# EAGLE board driver_board (EAGLE 6.4)
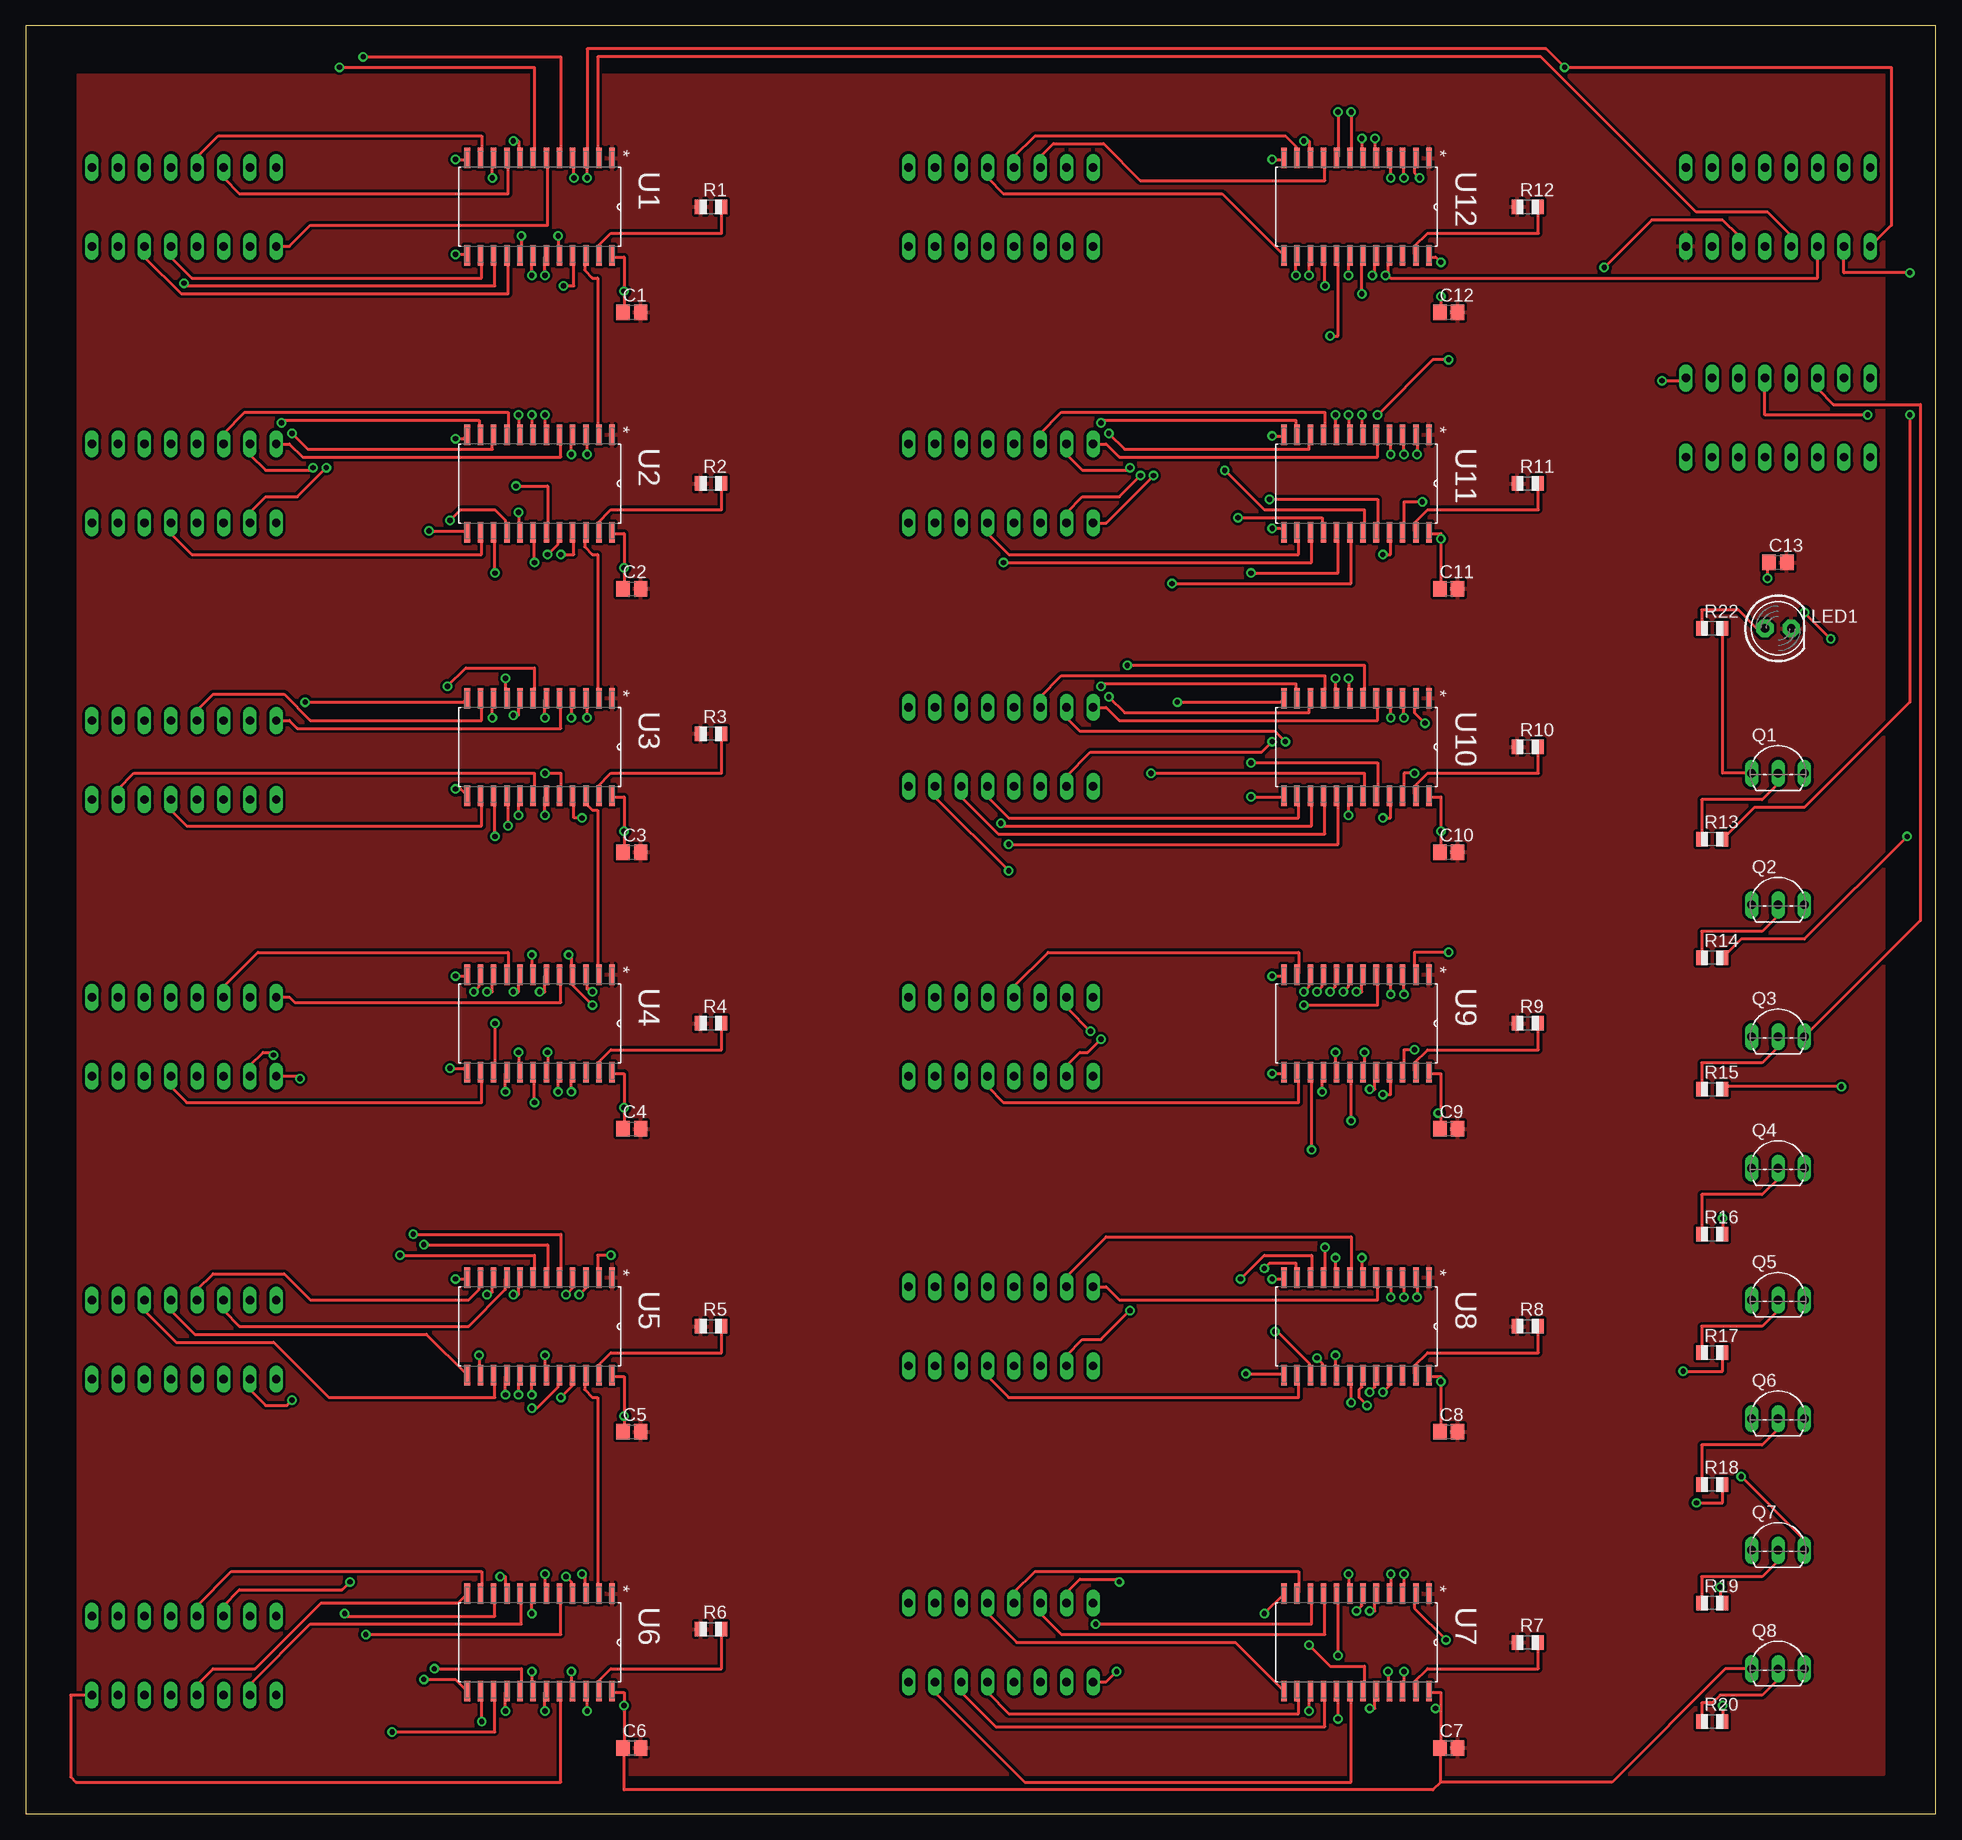
[diagram p2: board, top side]
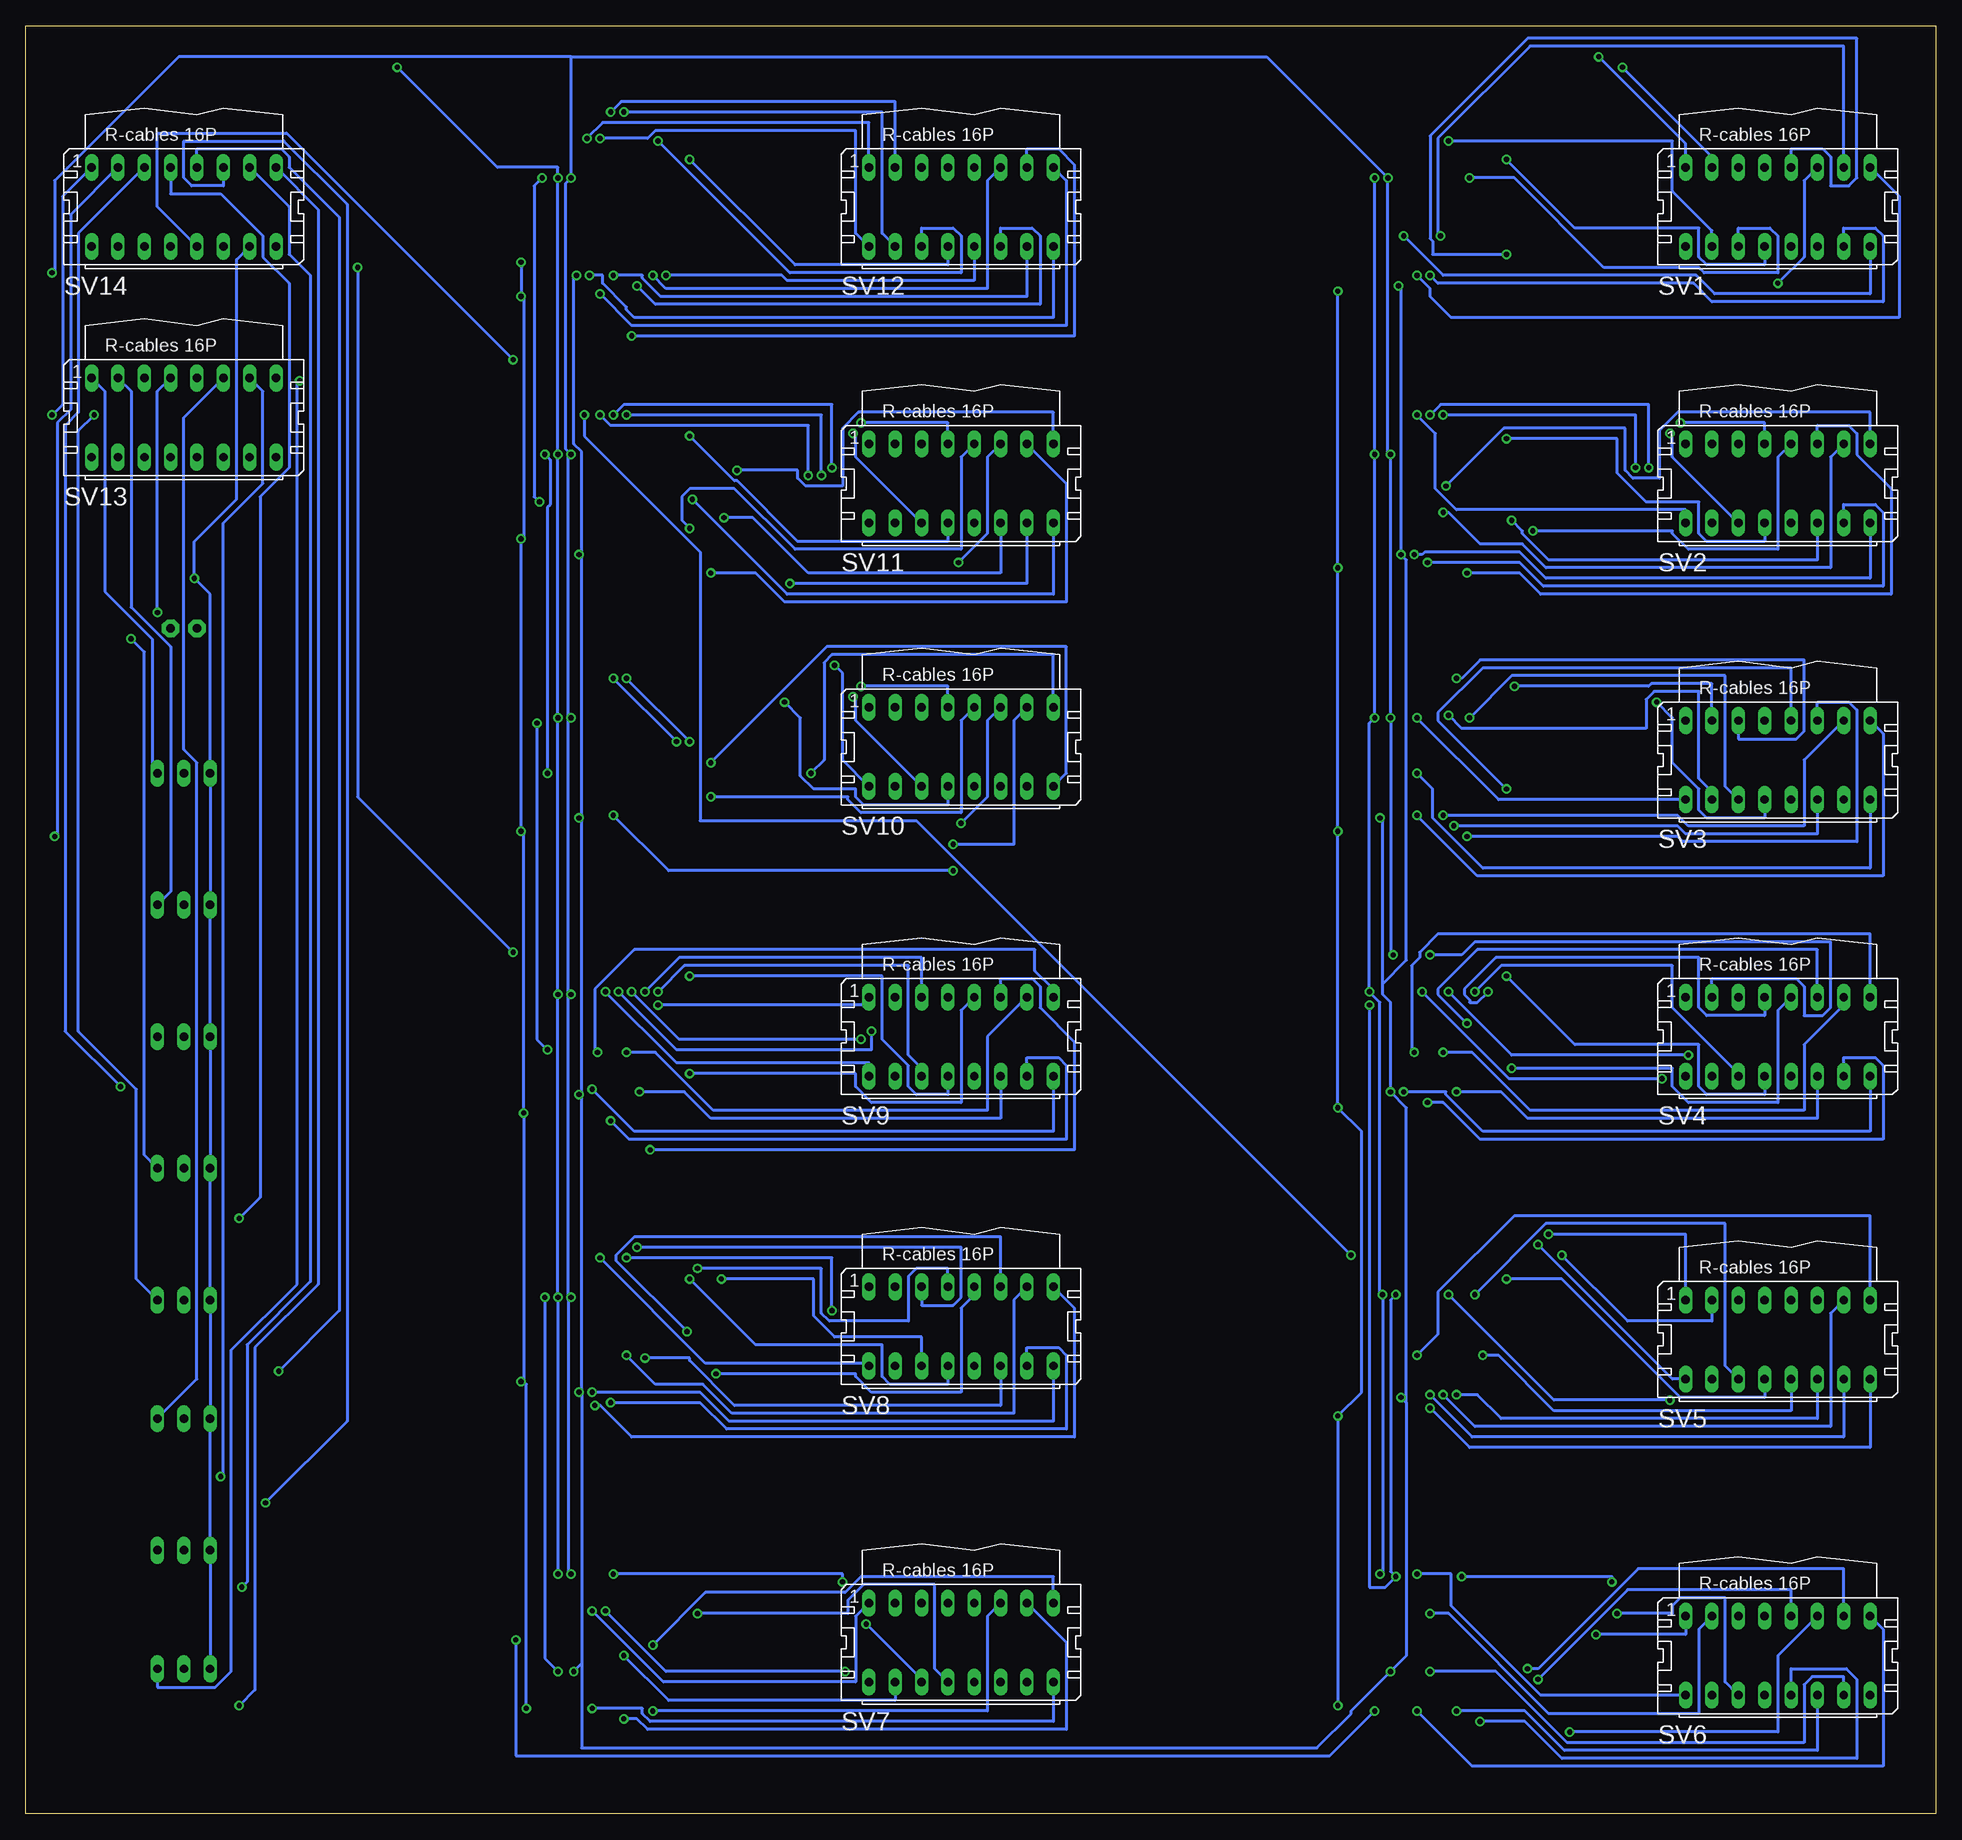
[diagram p3: board, bottom side, seen from below]

Size 184.13 x 172.39 mm. Coordinates in mm from the lower left corner, seen from the top.
Outline: 0,0 184.13,0 184.13,172.39 0,172.39 0,0
Copper layers (1*16): Top 0.035mm / dielectric 1.5mm / Bottom 0.035mm
Design rules "default *": minimum track width 10mil, minimum drill 10mil, track to track 8mil, track to pad 8mil, pad to pad 8mil, via to via 8mil, smd to smd 8mil, copper to edge 40mil, drill to drill 8mil, minimum pad ring 10mil, minimum via ring 8mil, stop-mask expansion 4mil, vias tented up to drill 0mil, thermal gap 10mil
Net classes: 0 default: width 0.305 mm, drill 0.508 mm, clearance 0.254 mm

## Footprints (pad centres in the part's own frame; a part is rotated, then mirrored left to right if it is on the bottom)
C0805 = smd 1.3 x 1.5: 1 -0.85,0; 2 0.85,0
LED5MM = drill 0.813 pad 1.676 octagon: A -1.27,0; K 1.27,0
TO92-EBC-OVAL = drill 0.813 long: B 0,-1.27; C 2.54,-1.27; E -2.54,-1.27
R0805 = smd 1.1 x 1.4: 1 -1,0; 2 1,0
16PL = drill 0.813 long: 1 -8.89,3.81; 2 -8.89,-3.81; 3 -6.35,3.81; 4 -6.35,-3.81; 5 -3.81,3.81; 6 -3.81,-3.81; 7 -1.27,3.81; 8 -1.27,-3.81; 9 1.27,3.81; 10 1.27,-3.81; 11 3.81,3.81; 12 3.81,-3.81; 13 6.35,3.81; 14 6.35,-3.81; 15 8.89,3.81; 16 8.89,-3.81
SOIC127P1032X265-24N = smd 1.981 x 0.533: 1 -4.699,6.985; 2 -4.699,5.715; 3 -4.699,4.445; 4 -4.699,3.175; 5 -4.699,1.905; 6 -4.699,0.635; 7 -4.699,-0.635; 8 -4.699,-1.905; 9 -4.699,-3.175; 10 -4.699,-4.445; 11 -4.699,-5.715; 12 -4.699,-6.985; 13 4.699,-6.985; 14 4.699,-5.715; 15 4.699,-4.445; 16 4.699,-3.175; 17 4.699,-1.905; 18 4.699,-0.635; 19 4.699,0.635; 20 4.699,1.905; 21 4.699,3.175; 22 4.699,4.445; 23 4.699,5.715; 24 4.699,6.985

## Placement (x,y rotation side)
C1  [C0805]  58.42,144.78 0 top
C2  [C0805]  58.42,118.11 0 top
C3  [C0805]  58.42,92.71 0 top
C4  [C0805]  58.42,66.04 0 top
C5  [C0805]  58.42,36.83 0 top
C6  [C0805]  58.42,6.35 0 top
C7  [C0805]  137.16,6.35 0 top
C8  [C0805]  137.16,36.83 0 top
C9  [C0805]  137.16,66.04 0 top
C10  [C0805]  137.16,92.71 0 top
C11  [C0805]  137.16,118.11 0 top
C12  [C0805]  137.16,144.78 0 top
C13  [C0805]  168.91,120.65 0 top
LED1  GREEN  [LED5MM]  168.91,114.3 0 top
Q1  2N2907  [TO92-EBC-OVAL]  168.91,101.6 0 top
Q2  2N2907  [TO92-EBC-OVAL]  168.91,88.9 0 top
Q3  2N2907  [TO92-EBC-OVAL]  168.91,76.2 0 top
Q4  2N2907  [TO92-EBC-OVAL]  168.91,63.5 0 top
Q5  2N2907  [TO92-EBC-OVAL]  168.91,50.8 0 top
Q6  2N2907  [TO92-EBC-OVAL]  168.91,39.37 0 top
Q7  2N2907  [TO92-EBC-OVAL]  168.91,26.67 0 top
Q8  2N2907  [TO92-EBC-OVAL]  168.91,15.24 0 top
R1  1K  [R0805]  66.04,154.94 0 top
R2  1K  [R0805]  66.04,128.27 0 top
R3  1K  [R0805]  66.04,104.14 0 top
R4  1K  [R0805]  66.04,76.2 0 top
R5  1K  [R0805]  66.04,46.99 0 top
R6  1K  [R0805]  66.04,17.78 0 top
R7  1K  [R0805]  144.78,16.51 0 top
R8  1K  [R0805]  144.78,46.99 0 top
R9  1K  [R0805]  144.78,76.2 0 top
R10  1K  [R0805]  144.78,102.87 0 top
R11  1K  [R0805]  144.78,128.27 0 top
R12  1K  [R0805]  144.78,154.94 0 top
R13  1k  [R0805]  162.56,93.98 0 top
R14  1k  [R0805]  162.56,82.55 0 top
R15  1k  [R0805]  162.56,69.85 0 top
R16  1k  [R0805]  162.56,55.88 0 top
R17  1k  [R0805]  162.56,44.45 0 top
R18  1k  [R0805]  162.56,31.75 0 top
R19  1k  [R0805]  162.56,20.32 0 top
R20  1k  [R0805]  162.56,8.89 0 top
R22  220  [R0805]  162.56,114.3 0 top
SV1  [16PL]  15.24,154.94 0 bottom
SV2  [16PL]  15.24,128.27 0 bottom
SV3  [16PL]  15.24,101.6 0 bottom
SV4  [16PL]  15.24,74.93 0 bottom
SV5  [16PL]  15.24,45.72 0 bottom
SV6  [16PL]  15.24,15.24 0 bottom
SV7  [16PL]  93.98,16.51 0 bottom
SV8  [16PL]  93.98,46.99 0 bottom
SV9  [16PL]  93.98,74.93 0 bottom
SV10  [16PL]  93.98,102.87 0 bottom
SV11  [16PL]  93.98,128.27 0 bottom
SV12  [16PL]  93.98,154.94 0 bottom
SV13  [16PL]  168.91,134.62 0 bottom
SV14  [16PL]  168.91,154.94 0 bottom
U1  STP16CPP05MTR  [SOIC127P1032X265-24N]  49.53,154.94 270 top
U2  STP16CPP05MTR  [SOIC127P1032X265-24N]  49.53,128.27 270 top
U3  STP16CPP05MTR  [SOIC127P1032X265-24N]  49.53,102.87 270 top
U4  STP16CPP05MTR  [SOIC127P1032X265-24N]  49.53,76.2 270 top
U5  STP16CPP05MTR  [SOIC127P1032X265-24N]  49.53,46.99 270 top
U6  STP16CPP05MTR  [SOIC127P1032X265-24N]  49.53,16.51 270 top
U7  STP16CPP05MTR  [SOIC127P1032X265-24N]  128.27,16.51 270 top
U8  STP16CPP05MTR  [SOIC127P1032X265-24N]  128.27,46.99 270 top
U9  STP16CPP05MTR  [SOIC127P1032X265-24N]  128.27,76.2 270 top
U10  STP16CPP05MTR  [SOIC127P1032X265-24N]  128.27,102.87 270 top
U11  STP16CPP05MTR  [SOIC127P1032X265-24N]  128.27,128.27 270 top
U12  STP16CPP05MTR  [SOIC127P1032X265-24N]  128.27,154.94 270 top

## Tracks (layer width: path | path; a pad name or v marks a point on that pad's centre or on a via)
+3V3  (via drill 0.51)
  Top 0.305: C1.1 57.66,144.78 v57.66,146.81 57.66,150.11 56.64,150.11 U1.24 | C2.1 57.66,118.11 v57.66,120.14 57.66,123.44 56.64,123.44 U2.24 | C3.1 57.66,92.71 v57.66,94.74 57.66,98.04 56.64,98.04 U3.24 | C4.1 57.66,66.04 v57.66,68.07 57.66,71.37 56.64,71.37 U4.24 | 57.66,6.35 v57.66,10.41 57.66,11.68 56.64,11.68 U6.24 | C5.1 57.66,36.83 v57.66,38.35 57.66,42.16 56.64,42.16 U5.24 | C11.1 136.4,118.11 v136.4,122.94 136.4,123.44 135.38,123.44 U11.24 | v136.4,146.3 136.4,144.78 C12.1 | v136.4,149.61 135.89,150.11 135.38,150.11 U12.24 | C10.1 136.4,92.71 v136.4,94.74 136.4,98.04 135.38,98.04 U10.24 | C8.1 136.4,36.83 v136.4,41.66 136.4,42.16 135.38,42.16 U8.24 | 136.4,67.56 136.4,71.37 135.38,71.37 U9.24 | 136.4,67.56 136.4,66.04 C9.1 | 136.4,67.56 v136.14,67.56 | Q1.E 163.58,100.33 163.58,114.3 R22.2 | v167.89,119.13 167.89,120.65 C13.1 | 136.4,9.91 136.4,11.68 135.38,11.68 U7.24 | 136.4,9.91 136.4,6.35 | 136.4,3.05 136.4,6.35 | 136.4,3.05 152.91,3.05 163.83,13.97 Q8.E | 136.4,6.35 C7.1 | v135.89,10.16 136.14,9.91 136.4,9.91 | 57.66,6.35 57.66,2.29 135.64,2.29 136.4,3.05 | 57.66,6.35 C6.1
  Bottom 0.305: v57.66,10.41 v57.66,38.35 55.37,40.64 55.37,65.79 v57.66,68.07 v57.66,94.74 v57.66,120.14 v57.66,146.81 | v136.4,149.61 v136.4,146.3 136.14,146.05 136.14,122.94 v136.4,122.94 v136.4,94.74 136.14,94.49 v136.14,67.56 136.14,41.66 | SV14.14 163.83,149.86 163.83,126.75 167.89,122.68 v167.89,119.13 166.37,117.6 Q1.E Q2.E Q3.E Q4.E Q5.E Q6.E Q7.E Q8.E | 136.14,41.66 135.89,41.4 v135.89,10.16 | 136.14,41.66 v136.4,41.66
CLK  (via drill 0.51)
  Top 0.305: v53.59,23.11 53.85,23.11 53.85,21.34 U6.3 | v53.34,50.04 54.1,50.8 54.1,51.56 U5.3 | v54.61,79.25 54.36,79.5 54.1,79.5 54.1,80.77 U4.3 | v54.1,105.66 54.1,107.44 U3.3 | v54.1,131.06 54.1,132.84 U2.3 | v54.1,157.73 54.1,159.51 U1.3 54.1,159.77 54.1,170.18 146.56,170.18 v148.34,168.4 179.83,168.4 179.83,153.16 SV14.2 | v132.84,23.11 132.84,21.34 U7.3 | v132.84,49.78 132.84,51.56 U8.3 | v132.84,78.99 132.84,80.77 U9.3 | v132.84,105.66 132.84,107.44 U10.3 | v132.84,131.06 132.84,132.84 U11.3 | v132.84,157.73 132.84,159.51 U12.3
  Bottom 0.305: v53.59,23.11 53.34,23.37 v53.34,50.04 53.59,50.29 53.59,78.23 v54.61,79.25 54.61,105.16 v54.1,105.66 v54.1,131.06 v54.1,157.73 | v132.84,23.11 v132.84,49.78 v132.84,78.99 v132.84,105.66 v132.84,131.06 v132.84,157.73 132.84,158.75 138.68,158.75 v148.34,168.4
GND
  pour Top: 5.08,167.64 179.07,167.64 179.07,3.81 5.08,3.81
LE  (via drill 0.51)
  Top 0.305: v52.07,22.86 52.58,22.35 52.58,21.34 U6.4 | v52.07,50.04 52.83,50.8 52.83,51.56 U5.4 | v52.32,82.8 52.58,82.8 52.58,81.03 U4.4 52.58,80.77 52.58,80.01 v54.61,77.98 | v52.58,105.66 52.58,107.44 U3.4 | v52.58,131.06 52.58,132.84 U2.4 | v52.83,157.73 52.83,159.51 U1.4 | v131.57,23.11 131.57,21.34 U7.4 | v131.57,49.78 131.57,51.56 U8.4 | v131.57,78.99 131.57,80.77 U9.4 | v131.57,105.66 131.57,107.44 U10.4 | v131.57,131.06 131.57,132.84 U11.4 | v131.57,157.73 131.57,159.51 U12.4 | SV14.4 175.26,148.59 v181.61,148.59
  Bottom 0.305: v52.07,50.04 52.58,49.53 52.58,23.37 v52.07,22.86 53.09,21.84 54.61,21.84 v54.61,77.98 | v52.32,82.8 52.58,83.06 v52.58,105.66 v52.58,131.06 52.83,131.32 v52.83,157.73 64.52,169.42 131.57,169.42 | v131.57,23.11 131.83,23.37 131.83,49.53 | 131.83,49.53 131.83,78.74 | 131.83,49.53 v131.57,49.78 | 131.83,78.74 131.83,105.41 | 131.83,78.74 v131.57,78.99 | 131.83,105.41 131.83,130.81 v131.57,131.06 132.08,131.57 132.08,157.23 v131.57,157.73 131.57,169.42 | 131.83,105.41 v131.57,105.66 | v181.61,148.59 181.36,148.84 181.36,157.48 169.42,169.42 131.57,169.42
N$1  (via drill 0.51)
  Top 0.305: v32.51,169.42 51.56,169.42 51.56,159.77 U1.5
  Bottom 0.305: v32.51,169.42 24.13,161.04 SV1.1
N$2
  Top 0.305: SV1.5 19.05,157.73 20.57,156.21 46.48,156.21 46.48,159.51 U1.9
N$3  (via drill 0.51)
  Top 0.305: v30.23,168.4 49.02,168.4 49.02,159.77 U1.7
  Bottom 0.305: v30.23,168.4 21.59,159.77 SV1.3
N$4
  Top 0.305: SV1.7 16.51,159.77 18.54,161.8 43.94,161.8 43.94,159.77 U1.11
N$5  (via drill 0.51)
  Top 0.305: v15.24,147.57 15.49,147.32 45.21,147.32 45.21,150.11 U1.15
  Bottom 0.305: v15.24,147.57 12.7,150.11 12.7,157.48 SV1.11
N$6  (via drill 0.51)
  Top 0.305: v47.75,152.15 47.75,150.37 U1.17
  Bottom 0.305: v47.75,152.15 48.01,152.4 48.01,161.54 39.12,170.43 8.89,170.43 SV1.13
N$7  (via drill 0.51)
  Top 0.305: v41.4,150.37 42.42,150.37 U1.13
  Bottom 0.305: v41.4,150.37 48.51,150.37 48.51,151.64 48.77,151.89 48.77,161.8 39.37,171.2 7.62,171.2 7.62,157.73 8.38,156.97 10.16,156.97 10.16,159.77 10.92,160.53 13.97,160.53 SV1.9
N$8  (via drill 0.51)
  Top 0.305: v50.04,148.34 50.04,150.11 U1.19
  Bottom 0.305: v50.04,148.34 48.77,147.07 48.77,146.3 46.74,144.27 3.56,144.27 3.56,155.96 SV1.15
N$9
  Top 0.305: SV1.2 25.4,151.13 27.43,153.16 50.29,153.16 50.29,159.51 U1.6
N$10  (via drill 0.51)
  Top 0.305: v46.99,161.29 47.5,161.29 47.5,159.77 U1.8
  Bottom 0.305: v46.99,161.29 25.4,161.29 25.4,156.46 21.59,152.65 SV1.4
N$11  (via drill 0.51)
  Top 0.305: v44.96,157.73 44.96,159.51 U1.10
  Bottom 0.305: v44.96,157.73 40.64,157.73 32,149.1 22.86,149.1 22.35,148.59 15.24,148.59 15.24,152.15 16,152.91 19.05,152.91 SV1.6
N$12  (via drill 0.51)
  Top 0.305: v41.4,159.51 42.42,159.51 U1.12
  Bottom 0.305: v41.4,159.51 34.8,152.91 22.86,152.91 22.86,150.11 22.1,149.35 16.51,149.35 SV1.8
N$13
  Top 0.305: SV1.10 13.97,150.11 16,148.08 43.94,148.08 43.94,150.11 U1.14
N$14
  Top 0.305: SV1.12 11.43,150.11 14.99,146.56 46.48,146.56 46.48,150.11 U1.16
N$15  (via drill 0.51)
  Top 0.305: v48.77,148.34 48.77,150.11 U1.18
  Bottom 0.305: v48.77,148.34 48.01,147.57 23.37,147.57 21.59,145.8 5.08,145.8 5.08,152.15 5.84,152.91 8.89,152.91 SV1.14
N$16  (via drill 0.51)
  Top 0.305: v51.31,152.15 51.31,150.37 U1.20
  Bottom 0.305: v51.31,152.15 47.5,148.34 23.11,148.34 21.34,146.56 6.35,146.56 SV1.16
N$18
  Top 0.305: SV2.1 25.4,132.08 26.67,130.81 51.56,130.81 51.56,132.84 U2.5
N$19
  Top 0.305: R1.2 67.06,154.94 67.06,152.4 56.39,152.4 55.12,151.13 55.12,150.37 U1.23
N$20  (via drill 0.51)
  Top 0.305: v48.77,134.87 48.77,133.1 U2.7 | v27.69,129.79 27.43,129.54 23.11,129.54 21.59,131.06 SV2.3
  Bottom 0.305: v48.77,134.87 47.75,135.89 27.69,135.89 v27.69,129.79
N$21
  Top 0.305: SV2.5 19.05,133.1 21.08,135.13 46.48,135.13 46.48,133.1 U2.9
N$22  (via drill 0.51)
  Top 0.305: v24.64,134.11 24.89,134.37 43.69,134.37 43.69,133.1 U2.11
  Bottom 0.305: v24.64,134.11 16.51,134.11 SV2.7
N$23  (via drill 0.51)
  Top 0.305: v45.21,119.63 45.21,123.44 U2.15
  Bottom 0.305: v45.21,119.63 40.13,119.63 38.1,117.6 4.32,117.6 4.32,127.76 7.62,131.06 7.62,133.1 8.38,133.86 11.43,133.86 SV2.11
N$24  (via drill 0.51)
  Top 0.305: v38.86,123.7 42.42,123.7 U2.13
  Bottom 0.305: v38.86,123.7 25.4,123.7 25.4,123.44 23.88,121.92 15.24,121.92 15.24,130.81 SV2.9
N$25  (via drill 0.51)
  Top 0.305: v47.5,125.48 47.5,123.7 U2.17
  Bottom 0.305: v47.5,125.48 46.99,125.48 43.94,122.43 39.88,122.43 37.59,120.14 10.16,120.14 10.16,130.81 SV2.13
N$26  (via drill 0.51)
  Top 0.305: v47.24,128.02 50.29,128.02 50.29,123.7 U2.19
  Bottom 0.305: v47.24,128.02 41.66,133.6 29.97,133.6 29.97,129.54 29.21,128.78 26.67,128.78 26.67,133.35 24.89,135.13 6.35,135.13 SV2.15
N$27  (via drill 0.51)
  Top 0.305: v50.04,134.87 50.04,133.1 U2.6
  Bottom 0.305: v50.04,134.87 48.26,133.1 48.26,127.76 46.23,125.73 24.13,125.73 SV2.2
N$28  (via drill 0.51)
  Top 0.305: v47.5,134.87 47.5,133.1 U2.8 | v28.96,129.79 26.16,127 23.11,127 21.59,125.48 SV2.4
  Bottom 0.305: v47.5,134.87 28.96,134.87 v28.96,129.79
N$29  (via drill 0.51)
  Top 0.305: v25.65,133.1 27.18,131.57 44.96,131.57 44.96,132.84 U2.10
  Bottom 0.305: v25.65,133.1 25.4,132.84 25.4,130.81 SV2.6
N$30  (via drill 0.51)
  Top 0.305: U2.12 42.16,132.59 v41.4,132.59
  Bottom 0.305: v41.4,132.59 30.73,132.59 30.73,129.29 27.94,126.49 22.86,126.49 22.86,123.44 22.1,122.68 16.51,122.68 SV2.8
N$31
  Top 0.305: SV2.10 13.97,123.44 16,121.41 43.94,121.41 43.94,123.44 U2.14
N$32  (via drill 0.51)
  Top 0.305: v40.89,124.71 41.91,125.73 45.21,125.73 46.23,124.71 46.23,123.7 U2.16
  Bottom 0.305: v40.89,124.71 39.88,123.7 39.88,123.44 37.34,120.9 11.43,120.9 SV2.12
N$33  (via drill 0.51)
  Top 0.305: v49.02,120.65 49.02,123.44 U2.18
  Bottom 0.305: v49.02,120.65 40.13,120.65 37.85,118.36 5.08,118.36 5.08,125.48 5.84,126.24 8.89,126.24 SV2.14
N$34  (via drill 0.51)
  Top 0.305: v50.29,121.41 51.31,122.43 51.31,123.44 U2.20
  Bottom 0.305: v50.29,121.41 49.53,121.41 49.28,121.67 40.13,121.67 37.59,119.13 6.35,119.13 SV2.16
N$36
  Top 0.305: R2.2 67.06,128.27 67.06,125.73 56.39,125.73 55.12,124.46 55.12,123.7 U2.23
N$37
  Top 0.305: SV3.1 25.4,105.41 26.16,104.65 51.56,104.65 51.56,107.44 U3.5
N$38  (via drill 0.51)
  Top 0.305: v40.64,108.71 42.42,110.49 49.02,110.49 49.02,107.7 U3.7
  Bottom 0.305: v40.64,108.71 27.69,108.71 27.43,108.97 21.59,108.97 SV3.3
N$39  (via drill 0.51)
  Top 0.305: v46.23,109.47 46.23,107.7 U3.9
  Bottom 0.305: v46.23,109.47 45.72,109.47 43.94,111.25 12.7,111.25 12.7,104.39 13.46,103.63 19.05,103.63 SV3.5
N$40
  Top 0.305: SV3.7 16.51,106.43 18.03,107.95 24.89,107.95 27.43,105.41 43.94,105.41 43.94,107.44 U3.11
N$41  (via drill 0.51)
  Top 0.305: v45.21,94.23 45.21,98.04 U3.15
  Bottom 0.305: v45.21,94.23 24.89,94.23 24.38,93.73 7.62,93.73 7.62,106.43 8.38,107.19 11.43,107.19 SV3.11
N$42  (via drill 0.51)
  Top 0.305: U3.13 41.91,98.81 v41.4,98.81
  Bottom 0.305: v41.4,98.81 48.01,105.41 48.01,106.17 43.69,110.49 13.97,110.49 SV3.9
N$43  (via drill 0.51)
  Top 0.305: v47.5,96.27 47.5,98.04 U3.17
  Bottom 0.305: v47.5,96.27 24.89,96.27 23.88,95.25 12.7,95.25 12.7,101.6 SV3.13
N$44  (via drill 0.51)
  Top 0.305: v50.04,96.27 50.04,98.04 U3.19
  Bottom 0.305: v50.04,96.27 44.2,90.42 5.08,90.42 5.08,104.14 SV3.15
N$45  (via drill 0.51)
  Top 0.305: v50.04,105.66 50.04,107.44 U3.6
  Bottom 0.305: v50.04,105.66 42.16,97.79 SV3.2
N$46  (via drill 0.51)
  Top 0.305: v46.99,105.92 47.5,105.92 47.5,107.44 U3.8
  Bottom 0.305: v46.99,105.92 45.72,104.65 27.94,104.65 27.94,107.44 27.18,108.2 22.86,108.2 22.86,99.82 21.59,98.55 SV3.4
N$47  (via drill 0.51)
  Top 0.305: v44.96,105.66 44.96,107.44 U3.10
  Bottom 0.305: v44.96,105.66 40.89,109.73 20.32,109.73 20.32,99.06 SV3.6
N$48  (via drill 0.51)
  Top 0.305: U3.12 42.16,107.19 v26.92,107.19
  Bottom 0.305: v26.92,107.19 25.4,105.66 25.4,101.35 22.86,98.81 22.86,96.77 22.1,96.01 16.51,96.01 SV3.8
N$49
  Top 0.305: SV3.10 13.97,96.77 15.49,95.25 43.94,95.25 43.94,98.04 U3.14
N$50  (via drill 0.51)
  Top 0.305: v46.48,95.25 46.48,98.04 U3.16
  Bottom 0.305: v46.48,95.25 24.89,95.25 24.13,94.49 11.43,94.49 SV3.12
N$51
  Top 0.305: SV3.14 8.89,98.81 10.41,100.33 49.02,100.33 49.02,98.3 U3.18
N$52  (via drill 0.51)
  Top 0.305: v50.04,100.33 51.56,100.33 51.56,98.3 U3.20
  Bottom 0.305: v50.04,100.33 48.51,98.81 48.51,96.01 43.69,91.19 6.35,91.19 SV3.16
N$54
  Top 0.305: R3.2 67.06,104.14 67.06,100.33 56.39,100.33 55.12,99.06 55.12,98.3 U3.23
N$55
  Top 0.305: SV4.1 25.4,78.74 25.91,78.23 51.56,78.23 51.56,80.77 U4.5
N$56  (via drill 0.51)
  Top 0.305: v48.77,82.8 48.77,81.03 U4.7
  Bottom 0.305: v48.77,82.8 45.72,82.8 44.45,84.07 10.16,84.07 10.16,77.72 10.92,76.96 12.7,76.96 12.7,79.76 13.46,80.52 21.59,80.52 SV4.3
N$57
  Top 0.305: SV4.5 19.05,79.76 22.35,83.06 46.48,83.06 46.48,81.03 U4.9
N$58  (via drill 0.51)
  Top 0.305: v43.18,79.25 43.69,79.76 43.69,80.77 U4.11
  Bottom 0.305: v43.18,79.25 44.2,78.23 44.96,78.23 44.96,78.49 45.47,78.99 45.47,79.5 42.42,82.55 22.86,82.55 22.86,77.72 22.1,76.96 16.51,76.96 SV4.7
N$59  (via drill 0.51)
  Top 0.305: v45.21,76.2 45.21,71.63 U4.15
  Bottom 0.305: v45.21,76.2 48.01,78.99 48.01,79.5 44.2,83.31 11.43,83.31 SV4.11
N$60  (via drill 0.51)
  Top 0.305: U4.13 42.16,71.88 v40.89,71.88
  Bottom 0.305: v40.89,71.88 25.4,71.88 25.4,70.1 23.88,68.58 15.24,68.58 15.24,77.47 SV4.9
N$61  (via drill 0.51)
  Top 0.305: v47.5,73.41 47.5,71.63 U4.17
  Bottom 0.305: v47.5,73.41 44.7,73.41 39.12,67.82 12.7,67.82 12.7,74.17 8.89,77.98 SV4.13
N$62  (via drill 0.51)
  Top 0.305: v50.29,73.41 50.29,71.63 U4.19
  Bottom 0.305: v50.29,73.41 50.55,73.66 50.55,81.79 49.78,82.55 49.78,83.06 48.01,84.84 6.35,84.84 SV4.15
N$63  (via drill 0.51)
  Top 0.305: v49.53,79.25 50.04,79.25 50.04,80.77 U4.6 | v26.42,70.87 26.16,71.12 SV4.2
  Bottom 0.305: v49.53,79.25 41.15,70.87 v26.42,70.87
N$64  (via drill 0.51)
  Top 0.305: v46.99,79.25 47.5,79.25 47.5,80.77 U4.8 | v23.88,73.15 23.62,73.41 22.86,73.41 21.59,72.14 SV4.4
  Bottom 0.305: v46.99,79.25 40.89,73.15 v23.88,73.15
N$65  (via drill 0.51)
  Top 0.305: v44.45,79.25 44.96,79.25 44.96,80.77 U4.10
  Bottom 0.305: v44.45,79.25 41.91,81.79 25.4,81.79 25.4,77.72 19.05,71.37 SV4.6
N$66  (via drill 0.51)
  Top 0.305: v41.4,80.77 42.42,80.77 U4.12
  Bottom 0.305: v41.4,80.77 34.8,74.17 22.86,74.17 22.86,70.1 22.1,69.34 16.51,69.34 SV4.8
N$67
  Top 0.305: SV4.10 13.97,70.1 15.49,68.58 43.94,68.58 43.94,71.37 U4.14
N$68  (via drill 0.51)
  Top 0.305: v46.23,69.6 46.23,71.37 U4.16
  Bottom 0.305: v46.23,69.6 41.91,69.6 39.37,67.06 11.43,67.06 SV4.12
N$69  (via drill 0.51)
  Top 0.305: v49.02,68.58 49.02,71.37 U4.18
  Bottom 0.305: v49.02,68.58 47.5,68.58 43.94,65.02 5.08,65.02 5.08,72.14 5.84,72.9 8.89,72.9 SV4.14
N$70  (via drill 0.51)
  Top 0.305: v51.31,69.6 51.31,71.37 U4.20
  Bottom 0.305: v51.31,69.6 47.24,69.6 47.24,69.34 43.69,65.79 6.35,65.79 SV4.16
N$72
  Top 0.305: R4.2 67.06,76.2 67.06,73.66 56.39,73.66 55.12,72.39 55.12,71.63 U4.23
N$73  (via drill 0.51)
  Top 0.305: v37.34,55.88 51.56,55.88 51.56,51.82 U5.5
  Bottom 0.305: v37.34,55.88 24.13,55.88 SV5.1
N$74  (via drill 0.51)
  Top 0.305: v36.07,53.85 49.02,53.85 49.02,51.82 U5.7
  Bottom 0.305: v36.07,53.85 29.72,47.5 21.59,47.5 SV5.3
N$75
  Top 0.305: SV5.5 19.05,48.51 20.57,46.99 42.67,46.99 46.23,50.55 46.23,51.56 U5.9
N$76
  Top 0.305: SV5.7 16.51,50.55 18.03,52.07 24.89,52.07 27.43,49.53 42.67,49.53 43.69,50.55 43.69,51.56 U5.11
N$77
  Top 0.305: SV5.11 11.43,48.51 14.48,45.47 23.88,45.47 29.21,40.13 45.21,40.13 45.21,42.16 U5.15
N$78
  Top 0.305: U5.13 38.61,46.23 16.26,46.23 13.97,48.51 SV5.9
N$79  (via drill 0.51)
  Top 0.305: v47.5,40.39 47.5,42.16 U5.17
  Bottom 0.305: v47.5,40.39 44.45,37.34 10.16,37.34 10.16,48.26 SV5.13
N$80  (via drill 0.51)
  Top 0.305: v50.04,44.2 50.04,42.42 U5.19
  Bottom 0.305: v50.04,44.2 48.01,46.23 48.01,50.29 40.64,57.66 6.35,57.66 SV5.15
N$81  (via drill 0.51)
  Top 0.305: v38.35,54.86 50.29,54.86 50.29,51.82 U5.6
  Bottom 0.305: v38.35,54.86 25.4,41.91 SV5.2
N$82  (via drill 0.51)
  Top 0.305: v46.99,50.04 47.5,50.04 47.5,51.56 U5.8 | v25.65,39.88 25.15,39.37 23.11,39.37 21.59,40.89 SV5.4
  Bottom 0.305: v46.99,50.04 36.83,39.88 v25.65,39.88
N$83  (via drill 0.51)
  Top 0.305: v44.45,50.04 44.7,50.29 44.96,50.29 44.96,51.56 U5.10
  Bottom 0.305: v44.45,50.04 37.59,56.9 20.32,56.9 20.32,43.18 SV5.6
N$84  (via drill 0.51)
  Top 0.305: v41.4,51.56 42.42,51.56 U5.12
  Bottom 0.305: v41.4,51.56 36.07,51.56 24.64,40.13 16.51,40.13 SV5.8
N$85  (via drill 0.51)
  Top 0.305: v43.69,44.2 43.69,42.42 U5.14
  Bottom 0.305: v43.69,44.2 42.16,44.2 36.83,38.86 13.97,38.86 SV5.10
N$86  (via drill 0.51)
  Top 0.305: v46.23,40.39 46.23,42.16 U5.16
  Bottom 0.305: v46.23,40.39 44.2,40.39 41.91,38.1 11.43,38.1 SV5.12
N$87  (via drill 0.51)
  Top 0.305: v48.77,40.39 48.77,42.16 U5.18
  Bottom 0.305: v48.77,40.39 44.7,36.32 8.89,36.32 SV5.14
N$88  (via drill 0.51)
  Top 0.305: v48.77,39.12 49.28,39.12 51.31,41.15 51.31,42.16 U5.20
  Bottom 0.305: v48.77,39.12 44.96,35.31 6.35,35.31 SV5.16
N$90
  Top 0.305: R5.2 67.06,46.99 67.06,44.45 56.39,44.45 55.12,43.18 55.12,42.42 U5.23
N$91  (via drill 0.51)
  Top 0.305: v32.77,17.27 51.56,17.27 51.56,21.08 U6.5
  Bottom 0.305: v32.77,17.27 24.13,17.27 SV6.1
N$92  (via drill 0.51)
  Top 0.305: v48.77,19.3 48.77,21.08 U6.7
  Bottom 0.305: v48.77,19.3 46.99,19.3 37.34,9.65 22.86,9.65 22.86,17.78 SV6.3
N$93  (via drill 0.51)
  Top 0.305: v45.72,22.86 46.23,22.86 46.23,21.34 U6.9 | v31.24,22.35 30.48,21.59 20.57,21.59 19.05,20.07 SV6.5
  Bottom 0.305: v45.72,22.86 31.24,22.86 v31.24,22.35
N$94
  Top 0.305: SV6.7 16.51,20.07 19.81,23.37 43.94,23.37 43.94,21.34 U6.11
N$95  (via drill 0.51)
  Top 0.305: v35.31,7.87 45.21,7.87 45.21,11.68 U6.15
  Bottom 0.305: v35.31,7.87 15.24,7.87 15.24,15.24 SV6.11
N$96  (via drill 0.51)
  Top 0.305: U6.13 41.4,12.95 v38.35,12.95
  Bottom 0.305: v38.35,12.95 29.72,21.59 13.97,21.59 SV6.9
N$97  (via drill 0.51)
  Top 0.305: v39.37,13.97 47.75,13.97 47.75,11.94 U6.17
  Bottom 0.305: v39.37,13.97 38.35,13.97 28.7,23.62 8.89,23.62 SV6.13
N$98  (via drill 0.51)
  Top 0.305: v50.04,9.91 50.04,11.68 U6.19
  Bottom 0.305: v50.04,9.91 44.7,4.57 5.08,4.57 5.08,17.78 SV6.15
N$99  (via drill 0.51)
  Top 0.305: v50.04,23.11 50.04,21.34 U6.6
  Bottom 0.305: v50.04,23.11 46.74,23.11 46.74,20.07 38.1,11.43 SV6.2
N$100
  Top 0.305: SV6.4 21.59,12.45 27.43,18.29 47.75,18.29 47.75,21.08 U6.8
N$101  (via drill 0.51)
  Top 0.305: v30.73,19.3 30.99,19.05 45.21,19.05 45.21,21.08 U6.10
  Bottom 0.305: v30.73,19.3 25.4,19.3 25.4,20.07 24.64,20.83 20.32,20.83 20.32,12.7 SV6.6
N$102
  Top 0.305: U6.12 41.66,20.32 28.45,20.32 22.1,13.97 18.03,13.97 16.51,12.45 SV6.8
N$103  (via drill 0.51)
  Top 0.305: v43.94,8.89 43.94,11.68 U6.14
  Bottom 0.305: v43.94,8.89 39.62,8.89 36.07,5.33 7.62,5.33 7.62,12.95 8.64,13.97 13.97,13.97 SV6.10
N$104  (via drill 0.51)
  Top 0.305: v46.23,9.91 46.23,11.68 U6.16
  Bottom 0.305: v46.23,9.91 39.62,9.91 35.81,6.1 11.43,6.1 SV6.12
N$105  (via drill 0.51)
  Top 0.305: v48.77,13.72 48.77,11.94 U6.18
  Bottom 0.305: v48.77,13.72 42.42,13.72 35.56,6.86 12.7,6.86 12.7,12.45 11.94,13.21 8.89,13.21 SV6.14
N$106
  Top 0.305: SV6.16 4.32,11.43 4.32,3.56 4.83,3.05 51.56,3.05 51.56,11.68 U6.20
N$108
  Top 0.305: R6.2 67.06,17.78 67.06,13.97 56.39,13.97 55.12,12.7 55.12,11.94 U6.23
N$109  (via drill 0.51)
  Top 0.305: v129.54,19.56 130.05,19.56 130.05,21.08 U7.5
  Bottom 0.305: v129.54,19.56 122.68,12.7 104.14,12.7 104.14,19.05 SV7.1
N$110  (via drill 0.51)
  Top 0.305: v127.51,23.11 127.51,21.34 U7.7 | v105.41,22.35 105.16,22.61 101.6,22.61 100.33,21.34 SV7.3
  Bottom 0.305: v127.51,23.11 105.41,23.11 v105.41,22.35
N$111
  Top 0.305: SV7.5 97.79,19.3 99.82,17.27 125.22,17.27 125.22,21.08 U7.9
N$112
  Top 0.305: SV7.7 95.25,21.34 97.28,23.37 122.68,23.37 122.68,21.34 U7.11
N$114
  Top 0.305: U7.13 116.59,16.51 95.5,16.51 92.71,19.3 SV7.9
N$115  (via drill 0.51)
  Top 0.305: v126.49,9.14 126.49,11.68 U7.17
  Bottom 0.305: v126.49,9.14 125.22,9.14 124.21,8.13 83.82,8.13 83.82,16.51 SV7.13
N$116  (via drill 0.51)
  Top 0.305: v123.7,16.26 125.73,14.22 129.03,14.22 129.03,11.94 U7.19
  Bottom 0.305: v123.7,16.26 118.62,21.34 105.16,21.34 103.63,22.86 85.09,22.86 SV7.15
N$117  (via drill 0.51)
  Top 0.305: v128.27,19.56 128.78,20.07 128.78,21.08 U7.6 | v105.16,13.72 104.14,12.7 SV7.2
  Bottom 0.305: v128.27,19.56 122.43,13.72 v105.16,13.72
N$118  (via drill 0.51)
  Top 0.305: v126.49,15.24 126.49,21.08 U7.8
  Bottom 0.305: v126.49,15.24 122.17,10.92 100.33,10.92 SV7.4
N$119  (via drill 0.51)
  Top 0.305: v103.12,18.29 123.95,18.29 123.95,21.08 U7.10
  Bottom 0.305: v103.12,18.29 97.79,12.95 SV7.6
N$120  (via drill 0.51)
  Top 0.305: v119.38,19.3 U7.12
  Bottom 0.305: v119.38,19.3 104.9,19.3 104.9,20.57 103.38,22.1 96.52,22.1 96.52,13.97 SV7.8
N$121
  Top 0.305: SV7.10 92.71,11.68 94.74,9.65 122.68,9.65 122.68,11.68 U7.14
N$122
  Top 0.305: SV7.12 90.17,11.68 93.47,8.38 125.22,8.38 125.22,11.68 U7.16
N$123
  Top 0.305: SV7.14 87.63,11.68 96.27,3.05 127.76,3.05 127.76,11.68 U7.18
N$124  (via drill 0.51)
  Top 0.305: v129.54,10.16 130.05,10.16 130.05,11.68 U7.20
  Bottom 0.305: v129.54,10.16 124.71,10.16 124.71,9.65 123.95,8.89 85.09,8.89 SV7.16
N$125  (via drill 0.51)
  Top 0.305: v123.7,9.91 123.7,11.68 U7.15
  Bottom 0.305: v123.7,9.91 91.44,9.91 91.44,19.05 SV7.11
N$126
  Top 0.305: R7.2 145.8,16.51 145.8,13.97 135.13,13.97 133.86,12.7 133.86,11.94 U7.23
N$127
  Top 0.305: SV8.1 104.14,50.8 105.41,49.53 130.3,49.53 130.3,51.56 U8.5
N$128
  Top 0.305: SV8.3 100.33,51.82 104.14,55.63 127.76,55.63 127.76,51.82 U8.7
N$129  (via drill 0.51)
  Top 0.305: v125.22,54.61 125.22,51.82 U8.9
  Bottom 0.305: v125.22,54.61 93.98,54.61 93.98,49.78 94.74,49.02 97.79,49.02 SV8.5
N$130  (via drill 0.51)
  Top 0.305: v119.38,52.58 119.89,53.09 122.43,53.09 122.43,51.82 U8.11
  Bottom 0.305: v119.38,52.58 107.44,52.58 107.44,48.26 106.68,47.5 99.06,47.5 99.06,51.82 98.3,52.58 95.25,52.58 SV8.7
N$131  (via drill 0.51)
  Top 0.305: v120.4,46.48 120.65,46.48 123.7,43.43 123.7,42.42 U8.15
  Bottom 0.305: v120.4,46.48 127.25,53.34 127.25,53.85 125.48,55.63 90.17,55.63 SV8.11
N$132  (via drill 0.51)
  Top 0.305: v117.6,42.42 121.16,42.42 U8.13
  Bottom 0.305: v117.6,42.42 104.14,42.42 104.14,42.16 102.62,40.64 93.98,40.64 93.98,48.77 92.71,50.04 SV8.9
N$133  (via drill 0.51)
  Top 0.305: v126.24,44.2 126.24,42.42 U8.17
  Bottom 0.305: v126.24,44.2 123.44,41.4 118.87,41.4 116.08,38.61 88.9,38.61 88.9,49.53 SV8.13
N$134  (via drill 0.51)
  Top 0.305: v129.29,39.37 128.52,40.13 128.52,40.89 128.78,41.15 128.78,42.16 U8.19
  Bottom 0.305: v129.29,39.37 128.78,39.37 125.73,36.32 83.06,36.32 83.06,48.77 SV8.15
N$135  (via drill 0.51)
  Top 0.305: v128.78,53.59 128.78,51.82 U8.6
  Bottom 0.305: v128.78,53.59 118.62,43.43 102.87,43.43 SV8.2
N$136  (via drill 0.51)
  Top 0.305: v126.24,53.59 126.24,51.82 U8.8 | v106.43,48.51 103.63,45.72 101.85,45.72 100.33,44.2 SV8.4
  Bottom 0.305: v126.24,53.59 106.43,53.59 v106.43,48.51
N$137  (via drill 0.51)
  Top 0.305: v117.09,51.56 119.38,53.85 123.95,53.85 123.95,51.82 U8.10
  Bottom 0.305: v117.09,51.56 108.2,51.56 108.2,48.01 106.17,45.97 97.79,45.97 SV8.6
N$138  (via drill 0.51)
  Top 0.305: v120.14,51.56 121.16,51.56 U8.12
  Bottom 0.305: v120.14,51.56 113.79,45.21 101.6,45.21 101.6,42.16 100.84,41.4 95.25,41.4 SV8.8
N$139
  Top 0.305: SV8.10 92.71,42.16 94.74,40.13 122.68,40.13 122.68,42.16 U8.14
N$140  (via drill 0.51)
  Top 0.305: v124.46,43.94 124.97,43.43 124.97,42.42 U8.16
  Bottom 0.305: v124.46,43.94 120.14,43.94 120.14,43.69 115.82,39.37 90.17,39.37 SV8.12
N$141  (via drill 0.51)
  Top 0.305: v127.76,39.62 127.76,42.16 U8.18
  Bottom 0.305: v127.76,39.62 119.13,39.62 116.59,37.08 83.82,37.08 83.82,44.2 84.58,44.96 87.63,44.96 SV8.14
N$142  (via drill 0.51)
  Top 0.305: v129.54,40.64 130.05,41.15 130.05,42.16 U8.20
  Bottom 0.305: v129.54,40.64 119.13,40.64 116.33,37.85 85.09,37.85 SV8.16
N$144
  Top 0.305: R8.2 145.8,46.99 145.8,44.45 135.13,44.45 133.86,43.18 133.86,42.42 U8.23
N$145  (via drill 0.51)
  Top 0.305: v123.19,77.98 130.3,77.98 130.3,80.77 U9.5
  Bottom 0.305: v123.19,77.98 102.87,77.98 SV9.1
N$146  (via drill 0.51)
  Top 0.305: v127,79.25 127.51,79.76 127.51,80.77 U9.7 | v102.62,75.44 100.33,77.72 SV9.3
  Bottom 0.305: v127,79.25 121.41,73.66 102.62,73.66 v102.62,75.44
N$147  (via drill 0.51)
  Top 0.305: v124.46,79.25 124.97,79.76 124.97,80.77 U9.9
  Bottom 0.305: v124.46,79.25 121.16,82.55 97.79,82.55 SV9.5
N$148
  Top 0.305: SV9.7 95.25,79.76 98.55,83.06 122.68,83.06 122.68,81.03 U9.11
N$149  (via drill 0.51)
  Top 0.305: v123.95,64.01 123.95,71.37 U9.15
  Bottom 0.305: v123.95,64.01 83.06,64.01 83.06,74.42 86.36,77.72 86.36,79.76 87.12,80.52 90.17,80.52 SV9.11
N$150  (via drill 0.51)
  Top 0.305: v120.14,71.37 121.16,71.37 U9.13
  Bottom 0.305: v120.14,71.37 104.14,71.37 104.14,70.1 102.62,68.58 93.98,68.58 93.98,77.47 SV9.9
N$151  (via drill 0.51)
  Top 0.305: v126.24,73.41 126.24,71.63 U9.17
  Bottom 0.305: v126.24,73.41 123.44,73.41 117.86,67.82 91.44,67.82 91.44,74.93 SV9.13
N$152  (via drill 0.51)
  Top 0.305: v129.03,73.41 129.03,71.63 U9.19
  Bottom 0.305: v129.03,73.41 129.29,73.66 129.29,79.5 125.48,83.31 86.87,83.31 86.87,81.28 85.09,79.5 SV9.15
N$153  (via drill 0.51)
  Top 0.305: v128.27,79.25 128.78,79.25 128.78,80.77 U9.6
  Bottom 0.305: v128.27,79.25 121.41,72.39 102.87,72.39 SV9.2
N$154  (via drill 0.51)
  Top 0.305: v125.73,79.25 126.24,79.76 126.24,80.77 U9.8 | v103.63,74.68 102.36,73.41 101.6,73.41 100.33,72.14 SV9.4
  Bottom 0.305: v125.73,79.25 121.16,74.68 v103.63,74.68
N$155  (via drill 0.51)
  Top 0.305: v123.19,79.25 123.7,79.76 123.7,80.77 U9.10
  Bottom 0.305: v123.19,79.25 120.65,81.79 99.06,81.79 99.06,73.15 97.79,71.88 SV9.6
N$156  (via drill 0.51)
  Top 0.305: v120.14,80.77 121.16,80.77 U9.12
  Bottom 0.305: v120.14,80.77 101.6,80.77 101.6,74.68 99.06,72.14 99.06,70.1 98.3,69.34 95.25,69.34 SV9.8
N$157
  Top 0.305: SV9.10 92.71,70.1 94.23,68.58 122.68,68.58 122.68,71.37 U9.14
N$158  (via drill 0.51)
  Top 0.305: v124.97,69.6 124.97,71.37 U9.16
  Bottom 0.305: v124.97,69.6 120.65,69.6 118.11,67.06 90.17,67.06 SV9.12
N$159  (via drill 0.51)
  Top 0.305: v127.76,66.8 127.76,71.37 U9.18
  Bottom 0.305: v127.76,66.8 125.98,65.02 83.82,65.02 83.82,72.14 84.58,72.9 87.63,72.9 SV9.14
N$160  (via drill 0.51)
  Top 0.305: v129.54,69.85 130.05,69.85 130.05,71.37 U9.20
  Bottom 0.305: v129.54,69.85 125.48,65.79 85.09,65.79 SV9.16
N$162
  Top 0.305: R9.2 145.8,76.2 145.8,73.66 135.13,73.66 133.86,72.39 133.86,71.63 U9.23
N$163
  Top 0.305: SV10.1 104.14,106.68 105.41,105.41 130.3,105.41 130.3,107.44 U10.5
N$164  (via drill 0.51)
  Top 0.305: v127.51,109.47 127.51,107.7 U10.7 | v121.41,103.38 120.4,104.39 101.6,104.39 100.33,105.66 SV10.3
  Bottom 0.305: v121.41,103.38 v127.51,109.47
N$165
  Top 0.305: SV10.5 97.79,107.7 99.82,109.73 125.22,109.73 125.22,107.7 U10.9
N$166  (via drill 0.51)
  Top 0.305: v103.63,108.71 103.89,108.97 122.43,108.97 122.43,107.7 U10.11
  Bottom 0.305: v103.63,108.71 95.25,108.71 SV10.7
N$167  (via drill 0.51)
  Top 0.305: v93.98,95.5 94.23,95.25 123.95,95.25 123.95,98.04 U10.15
  Bottom 0.305: v93.98,95.5 91.44,98.04 91.44,105.41 SV10.11
N$168  (via drill 0.51)
  Top 0.305: v118.11,98.04 121.16,98.04 U10.13
  Bottom 0.305: v118.11,98.04 104.9,98.04 104.9,97.79 103.63,96.52 93.98,96.52 93.98,105.41 SV10.9
N$169  (via drill 0.51)
  Top 0.305: v94.74,93.47 126.49,93.47 126.49,98.04 U10.17
  Bottom 0.305: v94.74,93.47 88.9,93.47 88.9,105.41 SV10.13
N$170  (via drill 0.51)
  Top 0.305: v108.46,100.33 129.03,100.33 129.03,98.3 U10.19
  Bottom 0.305: v108.46,100.33 107.19,101.6 107.19,111 106.43,111.76 85.09,111.76 SV10.15
N$171  (via drill 0.51)
  Top 0.305: v106.17,110.74 129.03,110.74 129.03,107.7 U10.6
  Bottom 0.305: v106.17,110.74 105.41,109.98 105.41,101.6 SV10.2
N$172  (via drill 0.51)
  Top 0.305: v126.24,109.47 126.24,107.7 U10.8 | v120.14,103.38 119.13,102.36 102.62,102.36 100.33,100.08 SV10.4
  Bottom 0.305: v120.14,103.38 v126.24,109.47
N$173  (via drill 0.51)
  Top 0.305: v104.39,107.7 105.92,106.17 123.7,106.17 123.7,107.44 U10.10
  Bottom 0.305: v104.39,107.7 104.14,107.44 104.14,105.41 SV10.6
N$174  (via drill 0.51)
  Top 0.305: U10.12 120.9,107.19 v111,107.19
  Bottom 0.305: v111,107.19 109.47,105.66 109.47,100.08 108.2,98.81 104.14,98.81 104.14,98.04 103.38,97.28 95.25,97.28 SV10.8
N$175
  Top 0.305: SV10.10 92.71,98.04 94.74,96.01 122.68,96.01 122.68,98.04 U10.14
N$176
  Top 0.305: SV10.12 90.17,98.04 93.73,94.49 125.22,94.49 125.22,98.04 U10.16
N$177  (via drill 0.51)
  Top 0.305: v127.51,96.27 127.51,98.04 U10.18 | v94.74,90.93 87.63,98.04 SV10.14
  Bottom 0.305: v127.51,96.27 122.17,90.93 v94.74,90.93
N$178  (via drill 0.51)
  Top 0.305: v118.11,101.35 130.3,101.35 130.3,98.3 U10.20
  Bottom 0.305: v118.11,101.35 106.93,112.52 83.82,112.52 83.82,100.33 SV10.16
N$180
  Top 0.305: R10.2 145.8,102.87 145.8,100.33 135.13,100.33 133.86,99.06 133.86,98.3 U10.23
N$181
  Top 0.305: SV11.1 104.14,132.08 105.41,130.81 130.3,130.81 130.3,132.84 U11.5
N$182  (via drill 0.51)
  Top 0.305: v127.51,134.87 127.51,133.1 U11.7 | v106.43,129.79 106.17,129.54 101.85,129.54 100.33,131.06 SV11.3
  Bottom 0.305: v127.51,134.87 126.49,135.89 106.43,135.89 v106.43,129.79
N$183
  Top 0.305: SV11.5 97.79,133.1 99.82,135.13 125.22,135.13 125.22,133.1 U11.9
N$184  (via drill 0.51)
  Top 0.305: v103.63,134.11 103.89,134.37 122.43,134.37 122.43,133.1 U11.11
  Bottom 0.305: v103.63,134.11 95.25,134.11 SV11.7
N$185  (via drill 0.51)
  Top 0.305: v94.23,120.65 123.95,120.65 123.95,123.44 U11.15
  Bottom 0.305: v94.23,120.65 91.44,123.44 91.44,130.81 SV11.11
N$186  (via drill 0.51)
  Top 0.305: U11.13 120.9,123.95 v120.14,123.95
  Bottom 0.305: v120.14,123.95 120.9,124.71 120.9,127 120.14,127.76 115.82,127.76 109.98,121.92 93.98,121.92 93.98,130.81 SV11.9
N$187  (via drill 0.51)
  Top 0.305: v118.11,119.63 126.49,119.63 126.49,123.44 U11.17
  Bottom 0.305: v118.11,119.63 113.79,119.63 111,116.84 83.82,116.84 83.82,128.27 SV11.13
N$188  (via drill 0.51)
  Top 0.305: v115.57,129.54 119.38,125.73 129.03,125.73 129.03,123.7 U11.19
  Bottom 0.305: v115.57,129.54 109.73,129.54 109.73,128.78 108.97,128.02 105.41,128.02 105.41,133.6 103.89,135.13 85.09,135.13 SV11.15
N$189  (via drill 0.51)
  Top 0.305: v128.78,134.87 128.78,133.1 U11.6 | v108.71,129.03 104.14,124.46 SV11.2
  Bottom 0.305: v128.78,134.87 127.76,133.86 108.71,133.86 v108.71,129.03
N$190  (via drill 0.51)
  Top 0.305: v126.24,134.87 126.24,133.1 U11.8 | v107.44,129.03 105.41,127 101.85,127 100.33,125.48 SV11.4
  Bottom 0.305: v126.24,134.87 107.44,134.87 v107.44,129.03
N$191  (via drill 0.51)
  Top 0.305: v104.39,133.1 105.92,131.57 123.7,131.57 123.7,132.84 U11.10
  Bottom 0.305: v104.39,133.1 104.14,132.84 104.14,130.81 SV11.6
N$192  (via drill 0.51)
  Top 0.305: v120.14,132.84 121.16,132.84 U11.12
  Bottom 0.305: v120.14,132.84 115.82,128.52 115.57,128.52 109.73,122.68 95.25,122.68 SV11.8
N$193
  Top 0.305: SV11.10 92.71,123.44 94.74,121.41 122.68,121.41 122.68,123.44 U11.14
N$194  (via drill 0.51)
  Top 0.305: v116.84,124.97 124.97,124.97 124.97,123.7 U11.16
  Bottom 0.305: v116.84,124.97 114.05,124.97 108.71,119.63 90.17,119.63 SV11.12
N$195  (via drill 0.51)
  Top 0.305: v110.49,118.62 127.76,118.62 127.76,123.44 U11.18
  Bottom 0.305: v110.49,118.62 87.63,118.62 SV11.14
N$196  (via drill 0.51)
  Top 0.305: v119.89,126.75 130.3,126.75 130.3,123.7 U11.20
  Bottom 0.305: v119.89,126.75 110.74,117.6 85.09,117.6 SV11.16
N$198
  Top 0.305: R11.2 145.8,128.27 145.8,125.73 135.13,125.73 133.86,124.46 133.86,123.7 U11.23
N$199  (via drill 0.51)
  Top 0.305: v130.05,161.54 130.05,159.77 U12.5
  Bottom 0.305: v130.05,161.54 128.52,163.07 102.87,163.07 SV12.1
N$200  (via drill 0.51)
  Top 0.305: v127.76,164.08 127.76,159.77 U12.7
  Bottom 0.305: v127.76,164.08 126.75,165.1 100.33,165.1 SV12.3
N$201
  Top 0.305: SV12.5 97.79,159.77 99.06,161.04 103.89,161.04 107.44,157.48 125.22,157.48 125.22,159.51 U12.9
N$202
  Top 0.305: SV12.7 95.25,159.77 97.28,161.8 121.41,161.8 122.43,160.78 122.43,159.77 U12.11
N$203  (via drill 0.51)
  Top 0.305: v123.7,148.34 123.7,150.11 U12.15
  Bottom 0.305: v123.7,148.34 122.43,147.07 91.44,147.07 91.44,157.48 SV12.11
N$204
  Top 0.305: U12.13 115.32,156.21 94.23,156.21 92.71,157.73 SV12.9
N$205  (via drill 0.51)
  Top 0.305: v125.73,142.49 126.49,142.49 126.49,150.11 U12.17
  Bottom 0.305: v125.73,142.49 83.06,142.49 83.06,159 84.58,160.53 87.63,160.53 SV12.13
N$206  (via drill 0.51)
  Top 0.305: v128.78,146.56 128.78,150.11 U12.19
  Bottom 0.305: v128.78,146.56 125.73,143.51 83.82,143.51 83.82,157.48 SV12.15
N$207  (via drill 0.51)
  Top 0.305: v128.78,161.54 128.78,159.77 U12.6
  Bottom 0.305: v128.78,161.54 124.21,161.54 123.44,162.31 104.14,162.31 104.14,152.4 SV12.2
N$208  (via drill 0.51)
  Top 0.305: v126.49,164.08 126.49,159.77 U12.8
  Bottom 0.305: v126.49,164.08 101.6,164.08 101.6,152.4 SV12.4
N$209  (via drill 0.51)
  Top 0.305: v123.19,161.29 123.7,161.29 123.7,159.77 U12.10
  Bottom 0.305: v123.19,161.29 110.49,148.59 93.98,148.59 93.98,152.15 94.74,152.91 97.79,152.91 SV12.6
N$210  (via drill 0.51)
  Top 0.305: v120.14,159.51 121.16,159.51 U12.12
  Bottom 0.305: v120.14,159.51 109.98,149.35 95.25,149.35 SV12.8
N$211  (via drill 0.51)
  Top 0.305: v122.43,148.34 122.43,150.11 U12.14
  Bottom 0.305: v122.43,148.34 111.25,148.34 110.74,147.83 92.71,147.83 SV12.10
N$212  (via drill 0.51)
  Top 0.305: v125.22,147.32 125.22,150.11 U12.16
  Bottom 0.305: v125.22,147.32 123.44,145.54 86.36,145.54 86.36,152.15 87.12,152.91 90.17,152.91 SV12.12
N$213  (via drill 0.51)
  Top 0.305: v127.51,148.34 127.51,150.11 U12.18
  Bottom 0.305: v127.51,148.34 124.71,148.34 124.71,148.08 122.94,146.3 87.63,146.3 SV12.14
N$214  (via drill 0.51)
  Top 0.305: v129.79,148.34 130.05,148.34 130.05,150.11 U12.20
  Bottom 0.305: v129.79,148.34 128.52,148.34 128.52,147.57 126.24,145.29 126.24,145.03 125.48,144.27 85.09,144.27 SV12.16
N$216
  Top 0.305: R12.2 145.8,154.94 145.8,152.4 135.13,152.4 133.86,151.13 133.86,150.37 U12.23
N$217
  Top 0.305: U2.2 55.12,133.1 55.12,148.08 54.61,148.08 53.85,148.84 53.85,150.11 U1.22
N$218
  Top 0.305: U3.2 55.12,107.7 55.12,121.41 54.61,121.41 53.85,122.17 53.85,123.44 U2.22
N$219
  Top 0.305: U4.2 55.12,81.03 55.12,96.77 54.61,96.77 54.1,97.28 54.1,98.04 U3.22
N$220
  Top 0.305: U6.2 55.12,21.34 55.12,40.13 54.61,40.13 53.85,40.89 53.85,42.16 U5.22
N$221  (via drill 0.51)
  Top 0.305: v54.1,9.91 54.1,11.68 U6.22 | v136.91,16.76 133.86,19.81 133.86,21.08 U7.2
  Bottom 0.305: v54.1,9.91 58.42,5.59 136.91,5.59 v136.91,16.76
N$222  (via drill 0.51)
  Top 0.305: v132.84,13.72 132.84,11.94 U7.22 | v134.11,49.78 134.11,51.56 U8.2
  Bottom 0.305: v132.84,13.72 134.11,14.99 v134.11,49.78
N$223  (via drill 0.51)
  Top 0.305: v133.86,73.66 132.84,73.66 132.84,71.63 U9.22 | v134.87,105.16 133.86,106.17 133.86,107.44 U10.2
  Bottom 0.305: v133.86,73.66 134.87,74.68 v134.87,105.16
N$224  (via drill 0.51)
  Top 0.305: v133.86,100.33 132.84,100.33 132.84,98.3 U10.22 | v134.11,131.06 134.11,132.84 U11.2
  Bottom 0.305: v133.86,100.33 133.86,125.98 133.6,126.24 133.6,130.56 v134.11,131.06
N$225  (via drill 0.51)
  Top 0.305: v134.62,126.49 132.84,126.49 132.84,123.7 U11.22 | v134.37,157.73 133.86,158.24 133.86,159.51 U12.2
  Bottom 0.305: v134.62,126.49 135.13,127 135.13,156.97 v134.37,157.73
N$226
  Bottom 0.305: Q1.C 171.96,100.84 171.96,113.28 176.53,117.86 176.53,137.16 SV13.1
N$227
  Bottom 0.305: Q2.C 170.18,88.9 170.18,112.52 173.99,116.33 173.99,137.16 SV13.3
N$228
  Top 0.305: Q3.C 182.63,86.11 182.63,135.89 174.24,135.89 172.72,137.41 SV13.5
N$229  (via drill 0.51)
  Top 0.305: v173.99,113.28 v171.45,115.82
  Bottom 0.305: SV13.7 171.45,137.16 v171.45,115.82 | v173.99,113.28 172.72,112.01 172.72,63.5 Q4.C
N$230  (via drill 0.51)
  Top 0.305: SV13.9 167.64,134.87 v177.55,134.87
  Bottom 0.305: v177.55,134.87 179.07,133.35 179.07,75.44 173.48,69.85 173.48,51.56 Q5.C
N$231
  Bottom 0.305: SV13.11 168.91,134.62 168.91,102.62 167.64,101.35 167.64,41.91 Q6.C
N$232
  Top 0.305: Q1.B 168.91,99.31 167.39,97.79 161.54,97.79 161.54,93.98 R13.1
N$233  (via drill 0.51)
  Top 0.305: v165.35,32.51 171.45,26.42 Q7.C
  Bottom 0.305: SV13.13 161.29,137.16 161.29,128.27 165.1,124.46 165.1,32.77 v165.35,32.51
N$234  (via drill 0.51)
  Top 0.305: SV13.15 159.77,138.18 v157.73,138.18
  Bottom 0.305: v157.73,138.18 157.99,137.92 157.99,51.05 164.34,44.7 164.34,13.72 165.86,12.19 171.45,12.19 Q8.C
N$235
  Top 0.305: Q8.B 168.91,12.95 167.39,11.43 163.32,11.43 162.56,10.67 161.54,10.67 161.54,8.89 R20.1
N$236
  Top 0.305: Q7.B 168.91,24.38 167.39,22.86 161.54,22.86 161.54,20.32 R19.1
N$237
  Top 0.305: Q6.B 168.91,37.08 167.39,35.56 161.54,35.56 161.54,31.75 R18.1
N$238
  Top 0.305: Q5.B 168.91,48.51 167.39,46.99 161.54,46.99 161.54,44.45 R17.1
N$239
  Top 0.305: Q4.B 168.91,61.21 167.39,59.69 161.54,59.69 161.54,55.88 R16.1
N$240
  Top 0.305: Q3.B 168.91,73.91 167.39,72.39 161.54,72.39 161.54,69.85 R15.1
N$241
  Top 0.305: Q2.B 168.91,86.61 167.39,85.09 161.54,85.09 161.54,82.55 R14.1
N$243  (via drill 0.51)
  Top 0.305: v163.58,10.41 163.58,8.89 R20.2
  Bottom 0.305: v163.58,10.41 162.05,11.94 162.05,44.96 155.96,51.05 155.96,154.69 SV14.15
N$244
  Top 0.305: LED1.A 166.88,114.3 165.1,116.08 161.54,116.08 161.54,114.3 R22.1
N$245  (via drill 0.51)
  Top 0.305: v163.32,21.84 163.32,20.32 R19.2
  Bottom 0.305: v163.32,21.84 162.81,22.35 162.81,45.21 156.72,51.31 156.72,148.34 158.75,150.37 158.75,154.94 SV14.13
N$246  (via drill 0.51)
  Top 0.305: v161.04,29.97 163.58,29.97 163.58,31.75 R18.2
  Bottom 0.305: v161.04,29.97 153.16,37.85 153.16,155.19 159.26,161.29 168.91,161.29 168.91,157.73 168.15,156.97 165.1,156.97 SV14.11
N$247  (via drill 0.51)
  Top 0.305: v159.77,42.67 163.58,42.67 163.58,44.45 R17.2
  Bottom 0.305: v159.77,42.67 153.92,48.51 153.92,153.92 158.75,158.75 158.75,159.77 159.51,160.53 167.64,160.53 SV14.9
N$248  (via drill 0.51)
  Top 0.305: v163.58,57.4 163.58,55.88 R16.2
  Bottom 0.305: v163.58,57.4 161.54,59.44 161.54,127 158.75,129.79 158.75,147.57 161.29,150.11 161.29,152.15 165.35,156.21 170.18,156.21 SV14.7
N$249  (via drill 0.51)
  Top 0.305: v175.01,70.1 163.83,70.1 163.58,69.85 R15.2
  Bottom 0.305: v175.01,70.1 180.34,75.44 180.34,133.86 179.07,135.13 179.07,152.4 SV14.5
N$250  (via drill 0.51)
  Top 0.305: v181.36,94.23 171.45,84.33 165.35,84.33 163.58,82.55 R14.2
  Bottom 0.305: v181.36,94.23 181.1,94.49 181.1,134.11 179.83,135.38 179.83,154.18 SV14.3
N$251  (via drill 0.51)
  Top 0.305: v181.61,134.87 181.61,107.19 171.45,97.03 166.62,97.03 163.58,93.98 R13.2
  Bottom 0.305: v181.61,134.87 180.59,135.89 180.59,155.96 SV14.1
SDI_B  (via drill 0.51)
  Top 0.305: v137.16,83.06 133.86,83.06 133.86,81.03 U9.2 | v152.15,149.1 156.72,153.67 163.58,153.67 165.1,152.15 SV14.12
  Bottom 0.305: v137.16,83.06 152.15,98.04 v152.15,149.1
SDI_G  (via drill 0.51)
  Top 0.305: v56.39,53.85 55.12,53.85 55.12,51.82 U5.2 | v130.3,134.87 135.64,140.21 v137.16,140.21
  Bottom 0.305: v56.39,53.85 98.3,95.76 119.13,95.76 119.13,121.67 130.3,132.84 v130.3,134.87 | v137.16,140.21 159,162.05 171.45,162.05 171.45,154.94 SV14.10
SDI_R
  Top 0.305: SV14.8 170.18,152.15 167.89,154.43 161.04,154.43 146.05,169.42 55.12,169.42 55.12,159.77 U1.2
~OE  (via drill 0.51)
  Top 0.305: v52.58,13.72 52.58,11.94 U6.21 | v51.56,40.13 52.83,41.4 52.83,42.16 U5.21 | v52.58,69.6 52.58,71.37 U4.21 | v53.59,96.01 52.83,96.01 52.83,98.04 U3.21 | v51.56,121.41 52.83,121.41 52.83,123.44 U2.21 | v51.82,147.32 52.83,147.32 52.83,150.11 U1.21 | v131.32,13.72 131.32,11.94 U7.21 | v130.81,40.64 131.57,41.4 131.57,42.16 U8.21 | v130.81,69.34 131.57,69.34 131.57,71.37 U9.21 | v130.81,96.01 131.57,96.01 131.57,98.04 U10.21 | v130.81,121.41 131.57,121.41 131.57,123.44 U11.21 | 131.32,148.34 131.32,150.11 U12.21 | SV14.6 172.72,148.08 131.57,148.08 131.32,148.34 | 131.32,148.34 v131.06,148.34
  Bottom 0.305: 51.05,39.62 51.05,15.24 v52.58,13.72 56.39,9.91 56.39,9.65 59.69,6.35 130.56,6.35 130.56,14.48 | v51.56,40.13 51.05,39.62 | 51.05,39.62 51.05,68.07 v52.58,69.6 52.58,78.23 53.34,78.99 53.34,80.01 | v53.59,96.01 53.34,95.76 53.34,80.01 | 53.34,80.01 51.05,82.3 51.05,120.9 v51.56,121.41 51.56,147.07 v51.82,147.32 | 130.56,14.48 v131.32,13.72 | 130.56,40.39 130.56,14.48 | 130.56,40.39 130.56,69.09 | 130.56,40.39 v130.81,40.64 | 130.56,69.09 130.56,95.76 | 130.56,69.09 v130.81,69.34 | 130.56,95.76 130.56,121.16 | 130.56,95.76 v130.81,96.01 | v131.06,148.34 131.32,148.08 131.32,132.08 130.56,131.32 130.56,121.16 | 130.56,121.16 v130.81,121.41